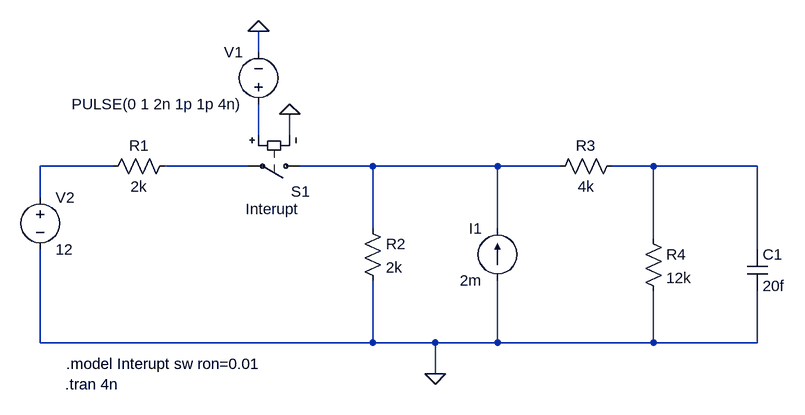
[diagram p0: schematic Circuit.asc]
Circuit.asc, the LTspice schematic file:
Version 4
SHEET 1 964 680
WIRE 80 -48 80 -80
WIRE 80 80 80 32
WIRE 128 80 128 48
WIRE -144 128 -256 128
WIRE 64 128 -64 128
WIRE 256 128 144 128
WIRE 448 128 256 128
WIRE 544 128 448 128
WIRE 688 128 624 128
WIRE 848 128 688 128
WIRE -256 176 -256 128
WIRE 256 224 256 128
WIRE 448 224 448 128
WIRE 688 240 688 128
WIRE 848 256 848 128
WIRE -256 400 -256 256
WIRE 256 400 256 304
WIRE 256 400 -256 400
WIRE 352 400 256 400
WIRE 448 400 448 304
WIRE 448 400 352 400
WIRE 688 400 688 320
WIRE 688 400 448 400
WIRE 848 400 848 320
WIRE 848 400 688 400
WIRE 352 448 352 400
FLAG 128 48 0
FLAG 80 -80 0
FLAG 352 448 0
SYMBOL sw 160 128 R90
WINDOW 0 39 1 VRight 2
WINDOW 3 66 100 VLeft 2
SYMATTR InstName S1
SYMATTR Value Interupt
SYMBOL voltage 80 48 R180
WINDOW 0 24 96 Left 2
WINDOW 3 24 16 Left 2
WINDOW 123 0 0 Left 0
WINDOW 39 0 0 Left 0
SYMATTR InstName V1
SYMATTR Value PULSE(0 1 2n 1p 1p 4n)
SYMBOL res -48 112 R90
WINDOW 0 0 56 VBottom 2
WINDOW 3 32 56 VTop 2
SYMATTR InstName R1
SYMATTR Value 2k
SYMBOL voltage -256 160 R0
WINDOW 123 0 0 Left 0
WINDOW 39 0 0 Left 0
SYMATTR InstName V2
SYMATTR Value 12
SYMBOL res 240 208 R0
SYMATTR InstName R2
SYMATTR Value 2k
SYMBOL current 448 304 R180
WINDOW 0 24 80 Left 2
WINDOW 3 24 0 Left 2
WINDOW 123 0 0 Left 0
WINDOW 39 0 0 Left 0
SYMATTR InstName I1
SYMATTR Value 2m
SYMBOL res 640 112 R90
WINDOW 0 0 56 VBottom 2
WINDOW 3 32 56 VTop 2
SYMATTR InstName R3
SYMATTR Value 4k
SYMBOL res 672 224 R0
SYMATTR InstName R4
SYMATTR Value 12k
SYMBOL cap 832 256 R0
SYMATTR InstName C1
SYMATTR Value 20f
TEXT -216 432 Left 2 !.model Interupt sw ron=0.01
TEXT -218 464 Left 2 !.tran 4n

The netlist it stands for:
* Circuit.asc
S1 N004 N003 N001 0 Interupt
V1 N001 0 PULSE(0 1 2n 1p 1p 4n)
R1 N003 N002 2k
V2 N002 0 12
R2 N004 0 2k
I1 0 N004 2m
R3 N005 N004 4k
R4 N005 0 12k
C1 N005 0 20f
.model Interupt sw ron=0.01
.tran 4n
.backanno
.end